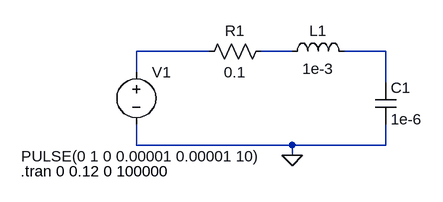
[diagram p0: schematic Draft1.asc]
Draft1.asc, the LTspice schematic file:
Version 4
SHEET 1 880 680
WIRE 96 112 -16 112
WIRE 224 112 176 112
WIRE 368 112 304 112
WIRE -16 144 -16 112
WIRE 368 160 368 112
WIRE -16 256 -16 224
WIRE 224 256 -16 256
WIRE 368 256 368 224
WIRE 368 256 224 256
WIRE 224 272 224 256
FLAG 224 272 0
SYMBOL res 192 96 R90
WINDOW 0 0 56 VBottom 2
WINDOW 3 32 56 VTop 2
SYMATTR InstName R1
SYMATTR Value 0.1
SYMBOL ind 208 128 R270
WINDOW 0 32 56 VTop 2
WINDOW 3 5 56 VBottom 2
SYMATTR InstName L1
SYMATTR Value 1e-3
SYMBOL cap 352 160 R0
SYMATTR InstName C1
SYMATTR Value 1e-6
SYMBOL voltage -16 128 R0
WINDOW 3 -177 145 Left 2
WINDOW 123 0 0 Left 0
WINDOW 39 0 0 Left 0
SYMATTR InstName V1
SYMATTR Value PULSE(0 1 0 0.00001 0.00001 10)
TEXT -194 296 Left 2 !.tran 0 0.12 0 100000

The netlist it stands for:
* Draft1.asc
R1 N002 N001 0.1
L1 N002 N003 1e-3
C1 N003 0 1e-6
V1 N001 0 PULSE(0 1 0 0.00001 0.00001 10)
.tran 0 0.12 0 100000
.backanno
.end